# EAGLE design main (EAGLE 9.0.0)
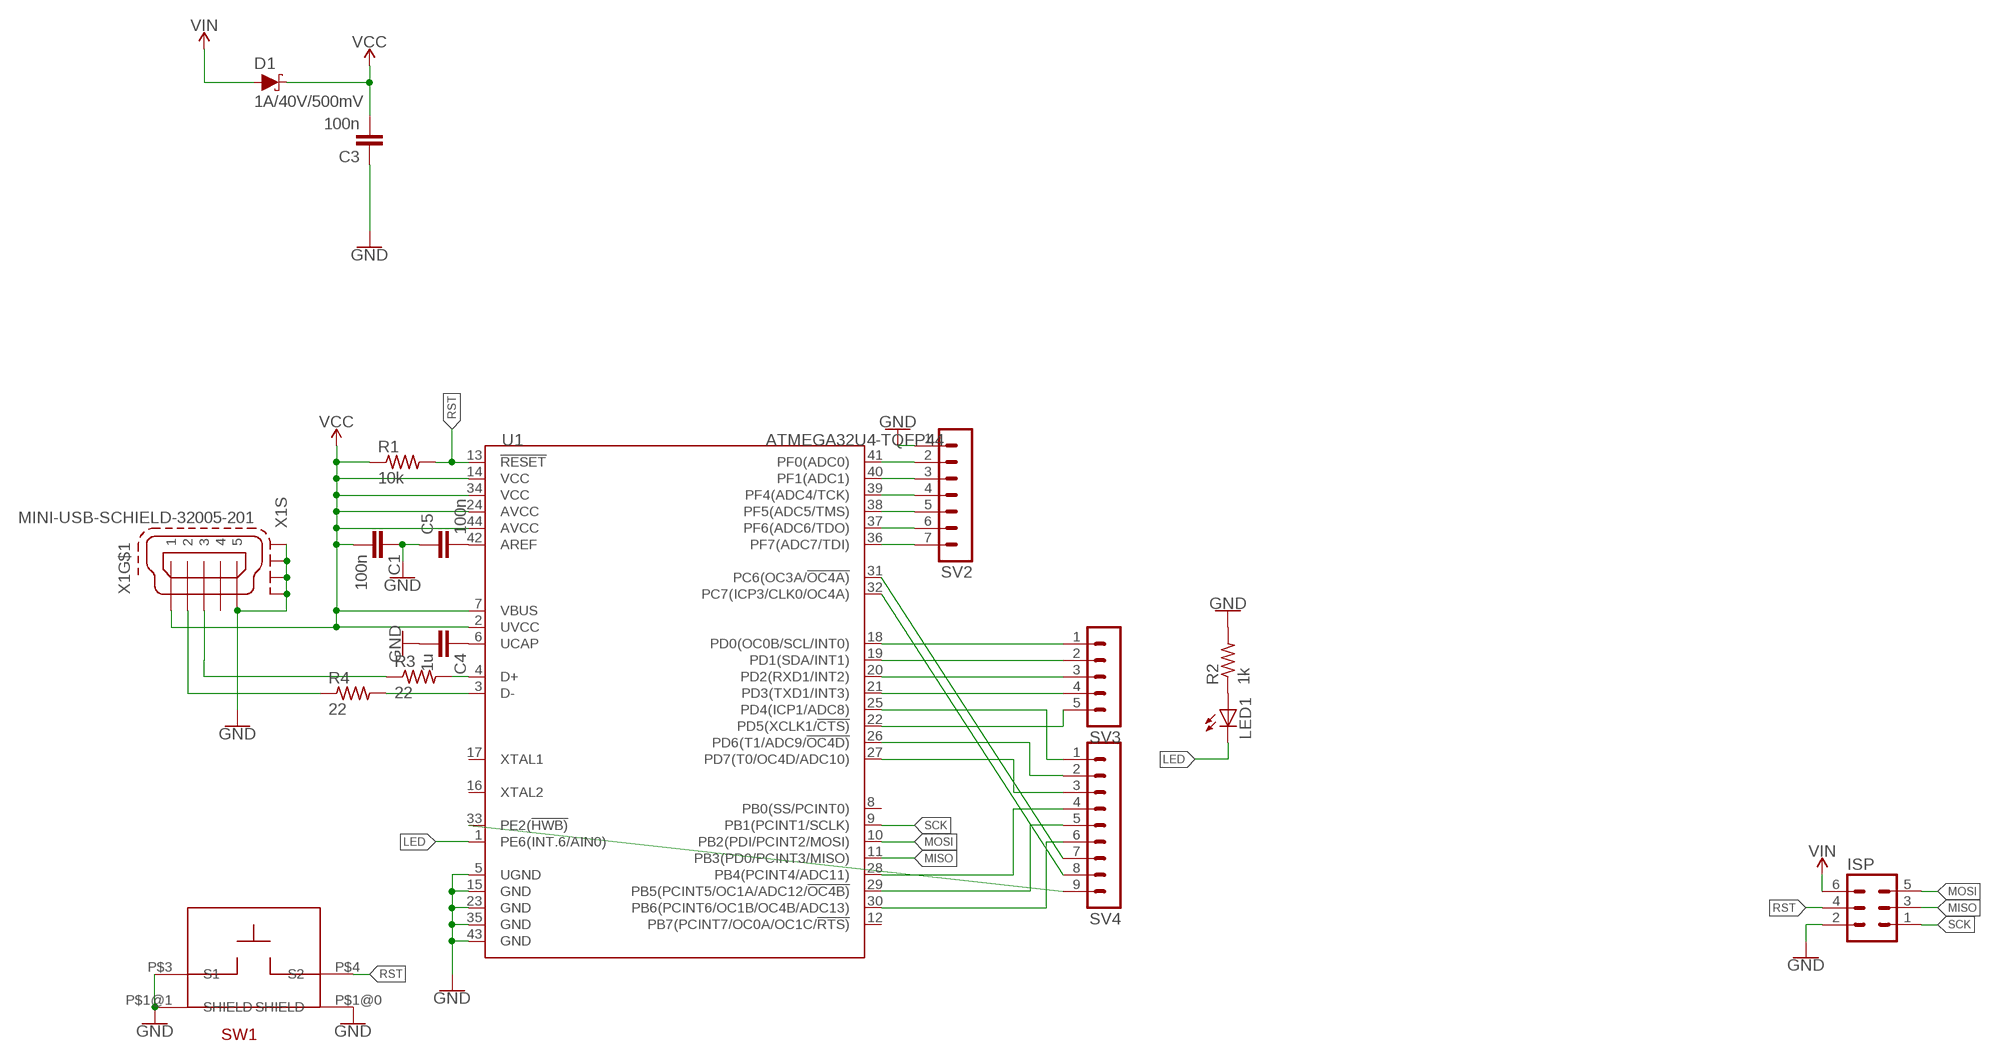
[diagram p0: schematic, sheet 1]

## Parts
C1  100n  C-EUC0402  [C0402]
C3  100n  C-EUC0603  [C0603]
C4  1u  C-EUC0603  [C0603]
C5  100n  C-EUC0603  [C0603]
D1  1A/40V/500mV  DIODE-SCHOTTKY-SS14  [SMA-DIODE]
ISP  MA03-2  [MA03-2]
LED1  LEDCHIP-LED0603  [CHIP-LED0603]
R1  10k  R-US_R0603  [R0603]
R2  1k  R-US_R0603  [R0603]
R3  22  R-US_R0603  [R0603]
R4  22  R-US_R0603  [R0603]
SV2  MA07-1  [MA07-1]
SV3  MA05-1  [MA05-1]
SV4  MA09-1  [MA09-1]
SW1  TL3330  [TL3330]
U1  ATMEGA32U4-TQFP44  MCU-ATMEGA32U4-AU(TQFP44)  [TQFP44-0.8-9.6X9.6MM]
X1  MINI-USB-SCHIELD-32005-201  [32005-201]

## Nets
GND: C1.1 C3.1 C4.2 C5.1 ISP.2 R2.2 SV2.1 SW1.P$1@0(SHIELD) SW1.P$1@1(SHIELD) SW1.P$3(S1) U1.5(UGND) U1.15(GND) U1.23(GND) U1.35(GND) U1.43(GND) X1.5 X1.M1(S:S1) X1.M2(S:S2) X1.M3(S:S3) X1.M4(S:S4)
LED: LED1.C U1.1(PE6(INT.6/AIN0))
MISO: ISP.3 U1.11(PB3(PD0/PCINT3/MISO))
MOSI: ISP.5 U1.10(PB2(PDI/PCINT2/MOSI))
N$1: LED1.A R2.1
N$2: R4.2 U1.3(D-)
N$3: R3.2 U1.4(D+)
N$4: SV3.1 U1.18(PD0(OC0B/SCL/INT0))
N$5: C4.1 U1.6(UCAP)
N$6: C5.2 U1.42(AREF)
N$7: SV3.2 U1.19(PD1(SDA/INT1))
N$8: SV3.3 U1.20(PD2(RXD1/INT2))
N$9: SV3.4 U1.21(PD3(TXD1/INT3))
N$10: R4.1 X1.2
N$11: R3.1 X1.3
N$12: SV3.5 U1.22(PD5(XCLK1/!CTS))
N$13: SV2.2 U1.41(PF0(ADC0))
N$14: SV2.3 U1.40(PF1(ADC1))
N$15: SV2.4 U1.39(PF4(ADC4/TCK))
N$16: SV2.5 U1.38(PF5(ADC5/TMS))
N$17: SV2.6 U1.37(PF6(ADC6/TDO))
N$18: SV2.7 U1.36(PF7(ADC7/TDI))
N$19: SV4.1 U1.25(PD4(ICP1/ADC8))
N$20: SV4.2 U1.26(PD6(T1/ADC9/!OC4D))
N$21: SV4.3 U1.27(PD7(T0/OC4D/ADC10))
N$22: SV4.4 U1.28(PB4(PCINT4/ADC11))
N$23: SV4.5 U1.29(PB5(PCINT5/OC1A/ADC12/!OC4B))
N$24: SV4.6 U1.30(PB6(PCINT6/OC1B/OC4B/ADC13))
N$25: SV4.7 U1.31(PC6(OC3A/!OC4A))
N$26: SV4.8 U1.32(PC7(ICP3/CLK0/OC4A))
N$27: SV4.9 U1.33(PE2(!HWB))
RST: ISP.4 R1.2 SW1.P$4(S2) U1.13(!RESET)
SCK: ISP.1 U1.9(PB1(PCINT1/SCLK))
VCC: C1.2 C3.2 D1.C R1.1 U1.2(UVCC) U1.7(VBUS) U1.14(VCC) U1.24(AVCC) U1.34(VCC) U1.44(AVCC) X1.1
VIN: D1.A ISP.6
Unconnected: U1.8(PB0(SS/PCINT0)) U1.12(PB7(PCINT7/OC0A/OC1C/!RTS)) U1.16(XTAL2) U1.17(XTAL1) X1.4

## Library data of the parts
C1 C3-C5 = rcl:C-EU: CAPACITOR, European symbol
D1 = SparkFun-DiscreteSemi:DIODE-SCHOTTKY: Schottky diode A Schottky diode is a semiconductor diode which has a low forward voltage drop and a very fast switching action.; PROD_ID: DIO-08053
ISP = con-lstb:MA03-2: PIN HEADER; OC_FARNELL: unknown; OC_NEWARK: unknown
LED1 = adafruit:LED: LED OSRAM: - CHIPLED LG R971, LG N971, LY N971, LG Q971, LY Q971, LO R971, LY R971 LH N974, LH R974 LS Q976, LO Q976, LY Q976 LO Q996 - Hyper CHIPLED LW Q18S LB Q993, LB Q99A, LB R99A - SideLED LS A670, LO A670, LY A670, LG A670, LP A670 LB A673, LV A673, LT A673, LW A673 LH A674 LY A675 LS A676, LA A676, LO A676, LY A676, LW A676 LS A679, LY A679, LG A679 - Hyper Micro SIDELED® LS Y876, LA Y876, LO Y876, LY Y876 LT Y87S - SmartLED LW L88C, LW L88S LB L89C, LB L89S, LG L890 LS L89K, LO L89K, LY L89K LS L896, LA L896, LO L896, LY L896 - TOPLED LS T670, LO T670, LY T670, LG T670, LP T670 LSG T670, LSP T670, LSY T670, LOP T670, LYG T670 LG T671, LOG T671, LSG T671 LB T673, LV T673, LT T673, LW T673 LH T674 LS T676, LA T676, LO T676, LY T676, LB T676, LH T676, LSB T676, LW T676 LB T67C, LV T67C, LT T67C, LS T67K, LO T67K, LY T67K, LW E67C LS E67B, LA E67B, LO E67B, LY E67B, LB E67C, LV E67C, LT E67C LW T67C LS T679, LY T679, LG T679 LS T770, LO T770, LY T770, LG T770, LP T770 LB T773, LV T773, LT T773, LW T773 LH T774 LS E675, LA E675, LY E675, LS T675 LS T776, LA T776, LO T776, LY T776, LB T776 LHGB T686 LT T68C, LB T68C - Hyper Mini TOPLED® LB M676 - Mini TOPLED Santana® LG M470 LS M47K, LO M47K, LY M47K Source: http://www.osram.convergy.de/
R1-R4 = resistor:R-US_: RESISTOR, American symbol
SV2 = con-lstb:MA07-1: PIN HEADER; OC_FARNELL: unknown; OC_NEWARK: unknown
SV3 = con-lstb:MA05-1: PIN HEADER; OC_FARNELL: unknown; OC_NEWARK: unknown
SV4 = con-lstb:MA09-1: PIN HEADER; OC_FARNELL: unknown; OC_NEWARK: unknown
SW1 = 7_segment_lib:TL3330
U1 = Seeed-IC:MCU-ATMEGA32U4-AU(TQFP44): 310010010; MPN: ATMEGA32U4
X1 = con-cypressindustries:MINI-USB-SCHIELD-: MINI USB-B Conector Source: www.cypressindustries.com; OC_FARNELL: unknown; OC_NEWARK: unknown

## Board
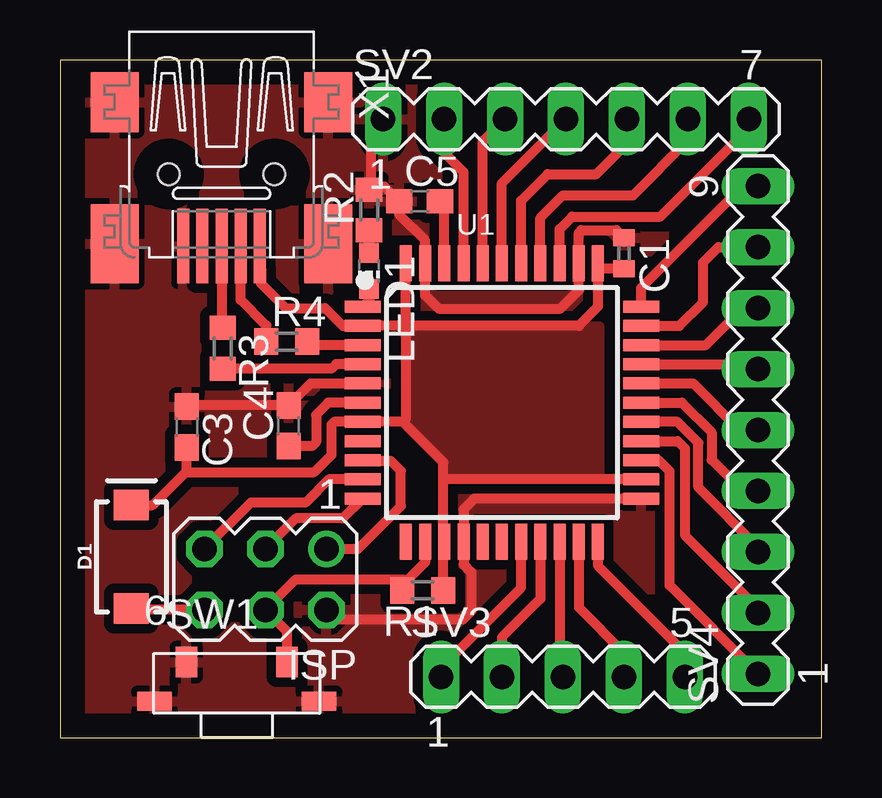
[diagram p1: board, top side]

Size 31.73 x 28.25 mm. Coordinates in mm from the lower left corner, seen from the top.
Outline: 0,0 31.73,0 31.73,28.25 0,28.25 0,0
Copper layers (1*16): Top 0.035mm / dielectric 1.5mm / Bottom 0.035mm
Design rules "default *": minimum track width 16mil, minimum drill 0.5mm, track to track 6mil, track to pad 6mil, pad to pad 6mil, via to via 6mil, smd to smd 6mil, copper to edge 40mil, drill to drill 6mil, minimum pad ring 10mil, minimum via ring 8mil, stop-mask expansion 4mil, vias tented up to drill 0mil, thermal gap 10mil

### Footprints (pad centres in the part's own frame; a part is rotated, then mirrored left to right if it is on the bottom)
C0402 = smd 0.7 x 0.9: 1 -0.65,0; 2 0.65,0
C0603 = smd 1.1 x 1: 1 -0.85,0; 2 0.85,0
SMA-DIODE = smd 1.27 x 1.47: A -2.15,0; C 2.15,0
MA03-2 = drill 1.016: 1 -2.54,-1.27 | drill 1.016 octagon: 2 -2.54,1.27; 3 0,-1.27; 4 0,1.27; 5 2.54,-1.27; 6 2.54,1.27
CHIP-LED0603 = smd 0.8 x 0.8: A 0,-0.75; C 0,0.75
R0603 = smd 1 x 1.1: 1 -0.85,0; 2 0.85,0
MA07-1 = drill 1.016 long: 1 -7.62,0; 2 -5.08,0; 3 -2.54,0; 4 0,0; 5 2.54,0; 6 5.08,0; 7 7.62,0
MA05-1 = drill 1.016 long: 1 -5.08,0; 2 -2.54,0; 3 0,0; 4 2.54,0; 5 5.08,0
MA09-1 = drill 1.016 long: 1 -10.16,0; 2 -7.62,0; 3 -5.08,0; 4 -2.54,0; 5 0,0; 6 2.54,0; 7 5.08,0; 8 7.62,0; 9 10.16,0
TL3330 = smd 1.45 x 0.8: P$1@0 -3.425,0; P$1@1 3.425,0 | smd 0.9 x 1.27: P$3 -2.1,1.635; P$4 2.1,1.635
TQFP44-0.8-9.6X9.6MM = smd 1.5 x 0.5: 1 -5.8,4; 2 -5.8,3.2; 3 -5.8,2.4; 4 -5.8,1.6; 5 -5.8,0.8; 6 -5.8,0; 7 -5.8,-0.8; 8 -5.8,-1.6; 9 -5.8,-2.4; 10 -5.8,-3.2; 11 -5.8,-4; 23 5.8,-4; 24 5.8,-3.2; 25 5.8,-2.4; 26 5.8,-1.6; 27 5.8,-0.8; 28 5.8,0; 29 5.8,0.8; 30 5.8,1.6; 31 5.8,2.4; 32 5.8,3.2; 33 5.8,4 | smd 0.5 x 1.5: 12 -4,-5.8; 13 -3.2,-5.8; 14 -2.4,-5.8; 15 -1.6,-5.8; 16 -0.8,-5.8; 17 0,-5.8; 18 0.8,-5.8; 19 1.6,-5.8; 20 2.4,-5.8; 21 3.2,-5.8; 22 4,-5.8; 34 4,5.8; 35 3.2,5.8; 36 2.4,5.8; 37 1.6,5.8; 38 0.8,5.8; 39 0,5.8; 40 -0.8,5.8; 41 -1.6,5.8; 42 -2.4,5.8; 43 -3.2,5.8; 44 -4,5.8
32005-201 = smd 3.1 x 0.5: 1 3,1.6; 2 3,0.8; 3 3,0; 4 3,-0.8; 5 3,-1.6 | smd 2.5 x 2: M1 -3,-4.45; M2 -3,4.45 | smd 3.3 x 2: M3 2.9,4.45; M4 2.9,-4.45 | hole 0.9: 0,2.2; 0,-2.2

### Placement (x,y rotation side)
C1  23.5,20.19 270 top
C3  5.28,12.95 270 top
C4  9.53,13 90 top
C5  14.99,22.35 0 top
D1  2.97,7.54 90 top
ISP  8.56,6.6 180 top
LED1  12.88,19.46 180 top
R1  15.11,6.15 180 top
R2  12.88,22 90 top
R3  6.78,16.23 270 top
R4  9.45,16.51 0 top
SV2  21.08,25.78 0 top
SV3  20.95,2.54 0 top
SV4  29.08,12.83 90 top
SW1  7.37,1.52 0 top
U1  18.41,13.97 0 top
X1  6.73,23.5 270 top

### Tracks (layer width: path | path; a pad name or v marks a point on that pad's centre or on a via)
GND
  Top 0.406: U1.23 17.26,9.97 16.82,9.53 U1.15 16.82,7.24 17.14,6.91 17.14,5.28 16.79,4.93 11.51,4.93 ISP.2 | U1.35 21.61,18.64 20.85,17.88 15.77,17.88 15.21,18.44 U1.43 15.21,20.73 14.14,21.8 C5.1 13.52,22.97 12.95,22.97 | U1.35 | C4.2 9.47,13.8 | 5.23,13.86 C3.1 | C4.2 5.23,13.86 | 5.23,13.86 | C4.2 10.44,14.77 U1.5 | R2.2 12.95,22.97 | SV2.1 12.95,25.27 12.95,22.97 | C1.1 23.18,21.16 21.72,21.16 21.61,21.06 U1.35
  pour Top (isolate 0.406, rank 2): -0.13,28.07 31.75,28.07 31.75,0 -0.13,0
LED
  Top 0.406: LED1.C 12.88,18.23 U1.1
MISO
  Top 0.406: U1.11 11.79,9.14 9.83,9.14 ISP.3
MOSI
  Top 0.406: U1.10 11.2,10.77 10.24,9.8 7.95,9.8 ISP.5
N$1
  Top 0.406: LED1.A R2.1
N$2
  Top 0.406: 12.6,16.38 U1.3 10.44,16.37 R4.2
N$3
  Top 0.406: R3.2 11.32,15.38 11.51,15.57 U1.4
N$4
  Top 0.406: SV3.1 15.88,2.92 19.21,6.26 U1.18
N$5
  Top 0.406: U1.6 11.18,13.97 10.67,13.46 10.67,12.32 10.5,12.15 C4.1
N$6
  Top 0.406: U1.42 16.02,22.17 C5.2
N$7
  Top 0.406: SV3.2 18.41,4.19 20.02,5.79 U1.19
N$8
  Top 0.406: U1.20 20.82,2.68 SV3.3
N$9
  Top 0.406: U1.21 21.61,5.44 23.5,3.56 SV3.4
N$10
  Top 0.406: R4.1 8.6,17.18 7.53,18.25 X1.2
N$11
  Top 0.406: R3.1 6.83,17.41 6.73,17.51 X1.3
N$12
  Top 0.406: U1.22 22.41,7.18 26.04,3.56 SV3.5
N$13
  Top 0.406: U1.41 16.82,23.57 16,24.38 SV2.2
N$14
  Top 0.406: U1.40 17.61,24.85 SV2.3
N$15
  Top 0.406: U1.39 18.41,23.11 SV2.4
N$16
  Top 0.406: U1.38 19.21,22.39 20.32,23.5 22.35,23.5 23.62,24.77 SV2.5
N$17
  Top 0.406: SV2.6 26.16,24.89 23.88,22.61 20.95,22.61 20.02,21.67 U1.37
N$18
  Top 0.406: U1.36 20.82,21.2 21.34,21.72 25.02,21.72 28.7,25.4 SV2.7
N$19
  Top 0.406: SV4.1 25.4,6.35 25.4,11.12 24.96,11.56 24.23,11.56 U1.25
N$20
  Top 0.406: SV4.2 29.08,5.4 26.04,8.45 26.04,12.06 25.73,12.37 U1.26
N$21
  Top 0.406: SV4.3 29.08,7.94 26.59,10.43 26.59,12.3 25.72,13.17 U1.27
N$22
  Top 0.406: U1.28 25.91,13.97 27.15,12.72 27.15,11.58 28.45,10.29 SV4.4
N$23
  Top 0.406: U1.29 26.38,14.77 28.32,12.83 SV4.5
N$24
  Top 0.406: U1.30 28.88,15.57 SV4.6
N$25
  Top 0.406: U1.31 26.91,16.37 28.45,17.91 SV4.7
N$26
  Top 0.406: U1.32 25.81,17.17 26.8,18.16 26.8,19.81 27.43,20.45 SV4.8
N$27
  Top 0.406: U1.33 24.21,18.75 28.45,22.99 SV4.9
RST
  Top 0.406: U1.13 15.21,7.32 14.5,6.6 14.5,6.39 | 14.5,6.39 R1.2 | 14.5,6.39 14.29,6.6 9.83,6.6 ISP.4 9.47,4.43 SW1.P$4
SCK
  Top 0.406: ISP.1 12.42,7.87 14.2,9.65 14.2,11.12 13.79,11.53 12.65,11.53 U1.9
VCC
  Top 0.406: 14.29,13.17 U1.7 11.42,13.17 11.3,13.06 11.3,11.79 10.59,11.07 5.33,11.07 5.28,11.12 | 14.29,13.17 15.98,11.48 15.98,10.87 | 15.98,8.21 15.98,10.87 | 15.98,8.21 U1.14 | U1.24 16.08,10.77 15.98,10.87 | 14.41,17.12 U1.44 | 14.41,17.12 14.41,13.3 14.29,13.17 | 14.37,17.17 U1.2 11.79,17.17 11.05,17.91 9.4,17.91 8.38,18.92 8.38,19.54 8.33,19.59 X1.1 | 14.37,17.17 14.41,17.12 | U1.34 22.41,19.56 | 22.41,19.56 22.41,17.97 21.61,17.17 14.37,17.17 | R1.1 15.96,8.2 15.98,8.21 | 5.28,11.12 C3.2 | D1.C 3.86,9.69 5.28,11.12 | C1.2 22.43,19.54 22.41,19.56
  pour Top (isolate 0.406, rank 2): 14.48,17.14 22.48,17.14 22.48,10.79 16,10.79 16,11.43 14.48,12.95
VIN
  Top 0.406: ISP.6 3.03,5.33 D1.A